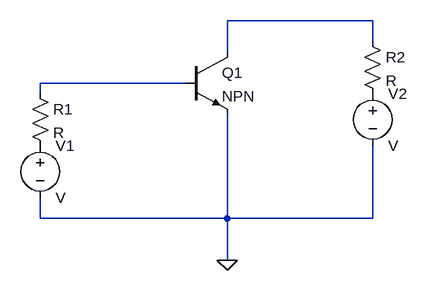
[diagram p0: schematic Draft1.asc]
Draft1.asc, the LTspice schematic file:
Version 4
SHEET 1 880 680
WIRE 544 -48 320 -48
WIRE 544 -16 544 -48
WIRE 320 0 320 -48
WIRE 256 48 32 48
WIRE 32 64 32 48
WIRE 32 256 32 224
WIRE 320 256 320 96
WIRE 320 256 32 256
WIRE 544 256 544 144
WIRE 544 256 320 256
WIRE 320 320 320 256
FLAG 320 320 0
SYMBOL voltage 32 128 R0
SYMATTR InstName V1
SYMBOL npn 256 0 R0
SYMATTR InstName Q1
SYMBOL res 16 48 R0
SYMATTR InstName R1
SYMBOL voltage 544 48 R0
SYMATTR InstName V2
SYMBOL res 528 -32 R0
SYMATTR InstName R2

The netlist it stands for:
* Draft1.asc
V1 P001 0 V
Q1 N001 N002 0 0 NPN
R1 N002 P001 R
V2 P002 0 V
R2 N001 P002 R
.model NPN NPN
.model PNP PNP
.lib standard.bjt
.backanno
.end